# EAGLE design テープLED制御回路 (EAGLE 9.6.2)
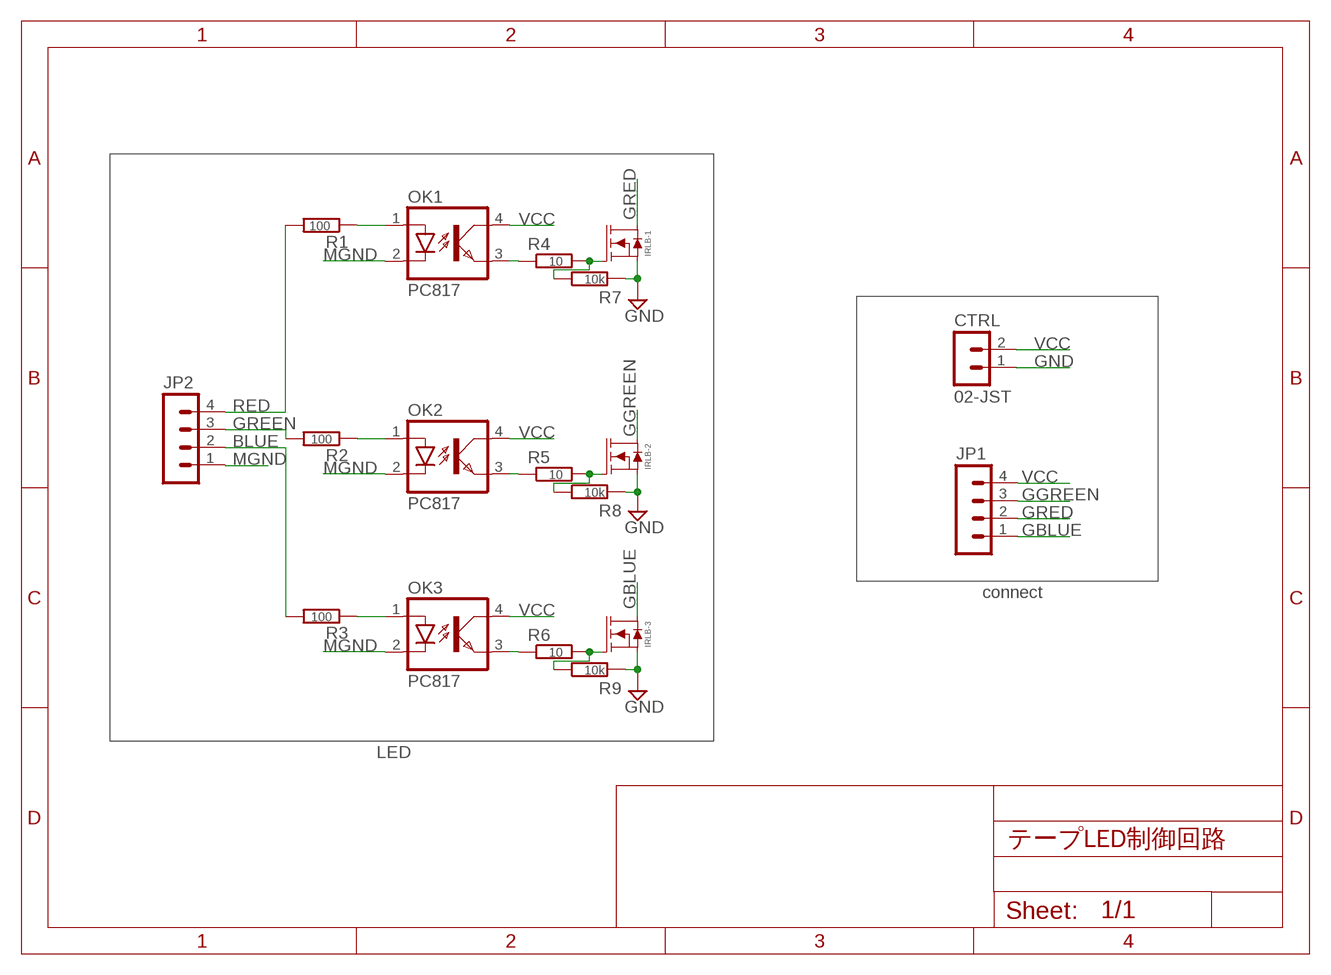
[diagram p0: schematic, sheet 1]

## Parts
CTRL  02-JST  [B2B-XH]
IRLB-1  IRLB3813STAND  [TO-220AB-STAND]
IRLB-2  IRLB3813STAND  [TO-220AB-STAND]
IRLB-3  IRLB3813STAND  [TO-220AB-STAND]
JP1  04-JST  [B4B-XH]
JP2  04-JST  [B4B-XH]
OK1  PC817  [DIL04]
OK2  PC817  [DIL04]
OK3  PC817  [DIL04]
R1  100  R-EU_0204/7  [0204/7]
R2  100  R-EU_0204/7  [0204/7]
R3  100  R-EU_0204/7  [0204/7]
R4  10  R-EU_0204/7  [0204/7]
R5  10  R-EU_0204/7  [0204/7]
R6  10  R-EU_0204/7  [0204/7]
R7  10k  R-EU_0204/7  [0204/7]
R8  10k  R-EU_0204/7  [0204/7]
R9  10k  R-EU_0204/7  [0204/7]

## Nets
BLUE: JP2.2 R3.2
GBLUE: IRLB-3.D JP1.1
GGREEN: IRLB-2.D JP1.3
GND: CTRL.1 IRLB-1.S IRLB-2.S IRLB-3.S R7.2 R8.2 R9.2
GRED: IRLB-1.D JP1.2
GREEN: JP2.3 R2.2
MGND: JP2.1 OK1.2(C) OK2.2(C) OK3.2(C)
N$3: OK1.3(EMIT) R4.1
N$4: OK1.1(A) R1.1
N$5: OK2.1(A) R2.1
N$6: OK3.1(A) R3.1
N$7: IRLB-1.G R4.2 R7.1
N$8: OK2.3(EMIT) R5.1
N$9: IRLB-2.G R5.2 R8.1
N$10: OK3.3(EMIT) R6.1
N$11: IRLB-3.G R6.2 R9.1
RED: JP2.4 R1.2
VCC: CTRL.2 JP1.4 OK1.4(COL) OK2.4(COL) OK3.4(COL)

## Notes on the sheet
- connect
- LED

## Library data of the parts
CTRL = con-jst-xh:02-JST: JST CONNECTOR
IRLB-1-IRLB-3 = OKUDA_libraries:IRLB3813
JP1 JP2 = con-jst-xh:04-JST: JST CONNECTOR
OK1-OK3 = optocoupler:PC817: SHARP OPTO COUPLER; MPN: PC817X4J000F; OC_FARNELL: 9707727; OC_NEWARK: 97K7059
R1-R9 = rcl:R-EU_: RESISTOR, European symbol; SPICEPREFIX: R

## Board
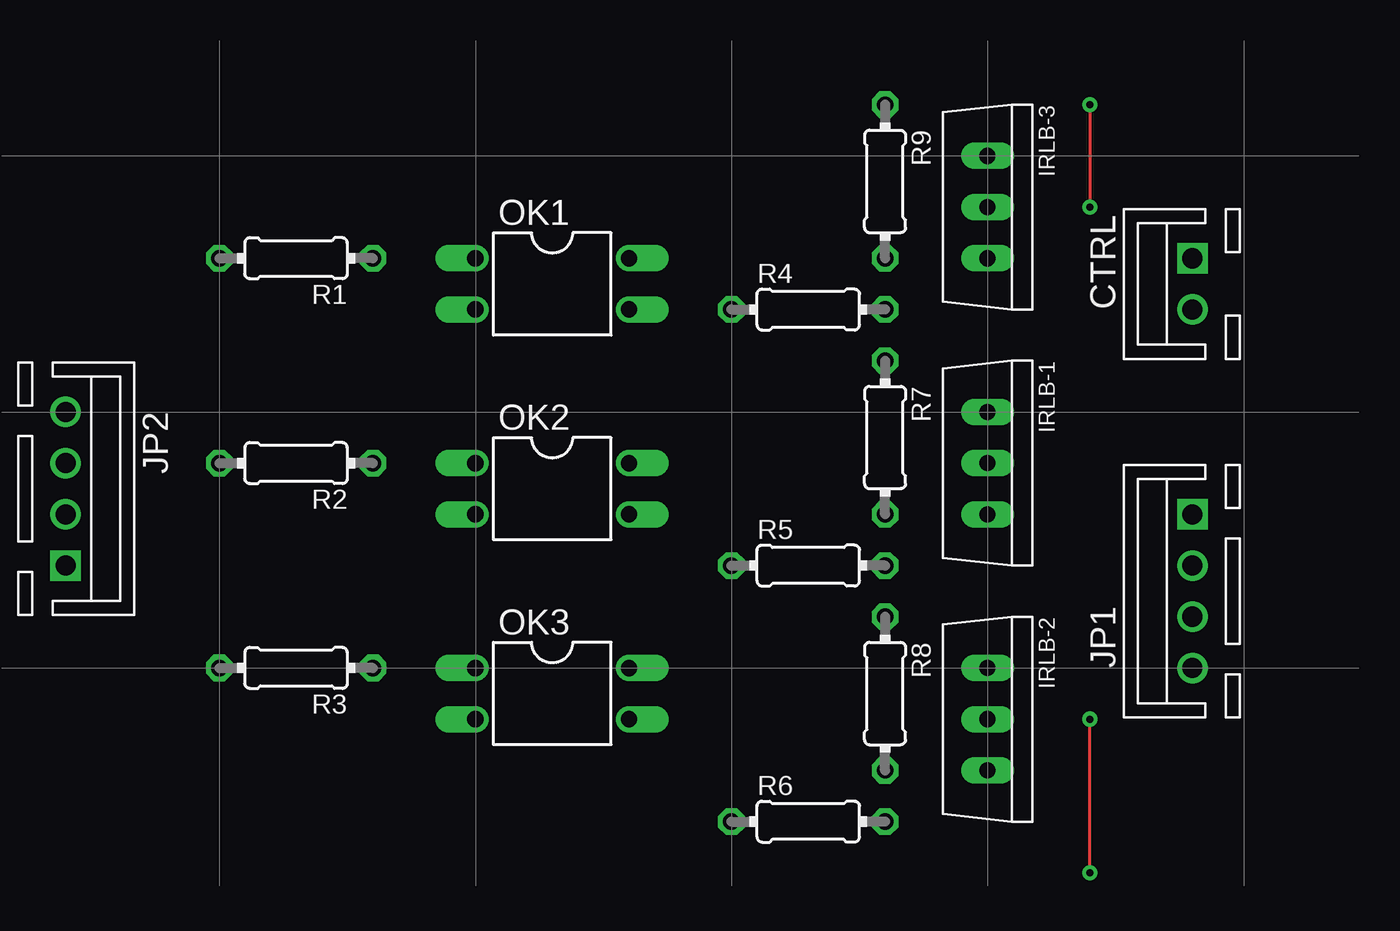
[diagram p1: board, top side]
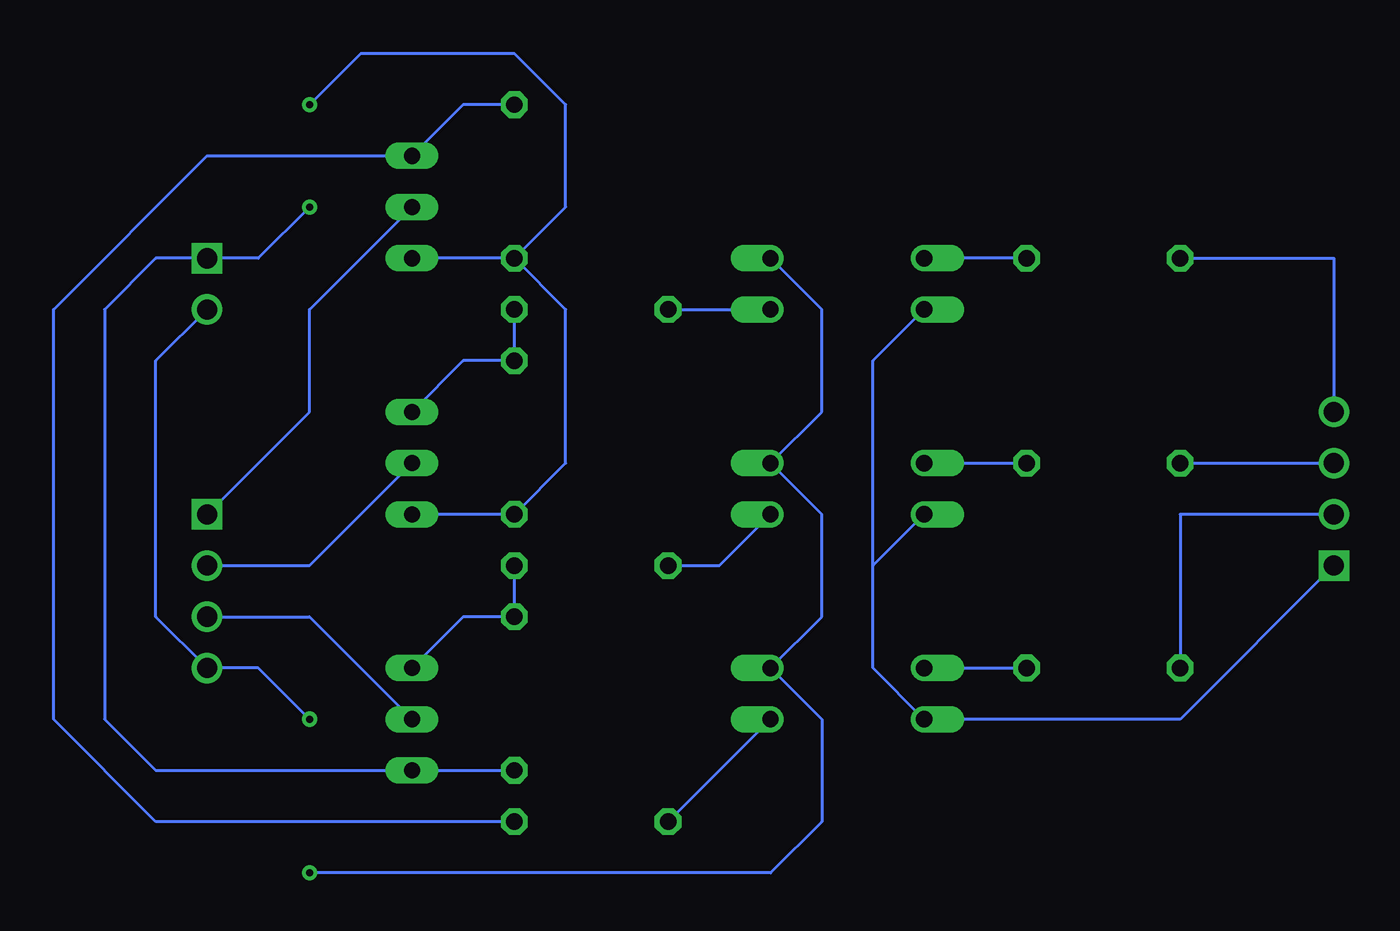
[diagram p2: board, bottom side, seen from below]

No outline drawn. Coordinates in mm, seen from the top.
Copper layers (1*16): Top 0.035mm / dielectric 1.5mm / Bottom 0.035mm
Design rules "default": minimum track width 6mil, minimum drill 0.35mm, track to track 6mil, track to pad 6mil, pad to pad 6mil, via to via 6mil, smd to smd 6mil, copper to edge 40mil, drill to drill 6mil, minimum pad ring 10mil, minimum via ring 8mil, stop-mask expansion 4mil, vias tented up to drill 0mil, thermal gap 10mil

### Footprints (pad centres in the part's own frame; a part is rotated, then mirrored left to right if it is on the bottom)
B2B-XH = drill 1 square: 1 1.27,0 | drill 1: 2 -1.27,0
TO-220AB-STAND = drill 0.8 long: D 0,0; G -2.54,0; S 2.54,0
B4B-XH = drill 1 square: 1 3.81,0 | drill 1: 2 1.27,0; 3 -1.27,0; 4 -3.81,0
DIL04 = drill 0.813 offset: 1 -1.27,-3.81; 2 1.27,-3.81; 3 1.27,3.81; 4 -1.27,3.81
0204/7 = drill 0.813 octagon: 1 -3.81,0; 2 3.81,0

### Placement (x,y rotation side)
CTRL  60.96,33.02 90 top
IRLB-1  50.8,24.13 270 top
IRLB-2  50.8,11.43 270 top
IRLB-3  50.8,36.83 270 top
JP1  60.96,17.78 90 top
JP2  5.08,22.86 270 top
OK1  29.21,33.02 270 top
OK2  29.21,22.86 270 top
OK3  29.21,12.7 270 top
R1  16.51,34.29 180 top
R2  16.51,24.13 180 top
R3  16.51,13.97 180 top
R4  41.91,31.75 0 top
R5  41.91,19.05 0 top
R6  41.91,6.35 0 top
R7  45.72,25.4 270 top
R8  45.72,12.7 270 top
R9  45.72,38.1 270 top
U$1  [TYPE.C]  0,1.27 0 top

### Tracks (layer width: path | path; a pad name or v marks a point on that pad's centre or on a via)
BLUE
  Bottom 0.152: JP2.2 12.7,21.59 R3.2
GBLUE
  Bottom 0.152: JP1.1 55.88,26.67 55.88,31.75 IRLB-3.D
GGREEN
  Bottom 0.152: JP1.3 55.88,16.51 IRLB-2.D
GND  (via drill 0.35)
  Top 0.152: v55.88,41.91 v55.88,36.83
  Bottom 0.152: R8.2 IRLB-2.S 63.5,8.89 66.04,11.43 66.04,31.75 63.5,34.29 CTRL.1 58.42,34.29 v55.88,36.83 | IRLB-1.S R7.2 43.18,24.13 43.18,31.75 R9.2 | R9.2 IRLB-3.S | R9.2 43.18,36.83 43.18,41.91 45.72,44.45 53.34,44.45 v55.88,41.91
GRED
  Bottom 0.152: JP1.2 55.88,19.05 IRLB-1.D
GREEN
  Bottom 0.152: R2.2 JP2.3
MGND
  Bottom 0.152: JP2.1 12.7,11.43 OK3.2 27.94,13.97 27.94,19.05 | 27.94,19.05 OK2.2 | 27.94,19.05 27.94,29.21 OK1.2
N$3
  Bottom 0.152: R4.1 OK1.3
N$4
  Bottom 0.152: R1.1 OK1.1
N$5
  Bottom 0.152: OK2.1 R2.1
N$6
  Bottom 0.152: OK3.1 R3.1
N$7
  Bottom 0.152: IRLB-1.G 48.26,29.21 R7.1 R4.2
N$8
  Bottom 0.152: R5.1 35.56,19.05 OK2.3
N$9
  Bottom 0.152: IRLB-2.G 48.26,16.51 R8.1 R5.2
N$10
  Bottom 0.152: R6.1 OK3.3
N$11
  Bottom 0.152: R9.1 48.26,41.91 IRLB-3.G 60.96,39.37 68.58,31.75 68.58,11.43 63.5,6.35 R6.2
RED
  Bottom 0.152: R1.2 5.08,34.29 JP2.4
VCC  (via drill 0.35)
  Top 0.152: v55.88,3.81 v55.88,11.43
  Bottom 0.152: CTRL.2 63.5,29.21 63.5,16.51 JP1.4 58.42,13.97 v55.88,11.43 | OK1.4 30.48,31.75 30.48,26.67 OK2.4 30.48,21.59 30.48,16.51 OK3.4 30.48,11.43 30.48,6.35 33.02,3.81 v55.88,3.81